# EAGLE design LTC Connector Interface (EAGLE 6.4)
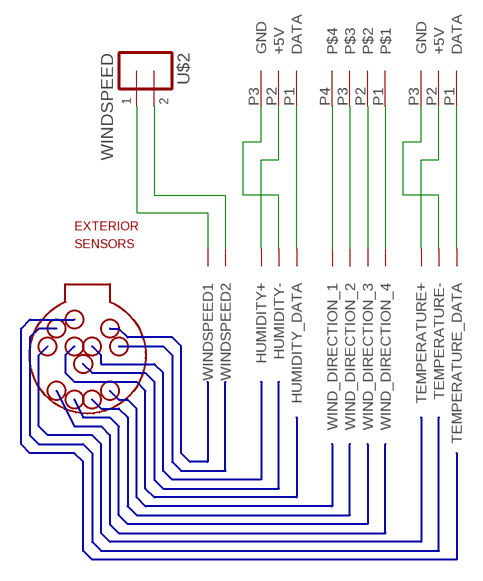
[diagram p0: schematic, sheet 1]

## Parts
HUMIDITY  MOLEX-3  [MOLEX-3]
TEMP  MOLEX-3  [MOLEX-3]
U$1  LAYOUT-LEMO-12PIN  [LEMO-12]
U$2  WINDSPEED  SCREW-TERMINAL-5MM  [SCREW-TERM-5MM]
WINDDIRECTION  MOLEX-4  [MOLEX-4]

## Nets
N$1: U$1.P6(WINDSPEED1) U$2.1
N$2: U$1.P5(WINDSPEED2) U$2.2
N$3: U$1.P3(WIND_DIRECTION_3) WINDDIRECTION.P2
N$4: U$1.P10(WIND_DIRECTION_2) WINDDIRECTION.P3
N$5: U$1.P11(WIND_DIRECTION_1) WINDDIRECTION.P4
N$6: U$1.P4(WIND_DIRECTION_4) WINDDIRECTION.P1
N$7: TEMP.P1(DATA) U$1.P1(TEMPERATURE_DATA)
N$8: TEMP.P3(GND) U$1.P8(TEMPERATURE-)
N$9: TEMP.P2(+5V) U$1.P7(TEMPERATURE+)
N$10: HUMIDITY.P1(DATA) U$1.P2(HUMIDITY_DATA)
N$11: HUMIDITY.P2(+5V) U$1.P12(HUMIDITY+)
N$12: HUMIDITY.P3(GND) U$1.P9(HUMIDITY-)

## Library data of the parts
HUMIDITY TEMP = launch-tower:MOLEX-3
U$1 = launch-tower:LAYOUT-LEMO-12PIN
U$2 = launch-tower:SCREW-TERMINAL-5MM
WINDDIRECTION = launch-tower:MOLEX-4

## Board
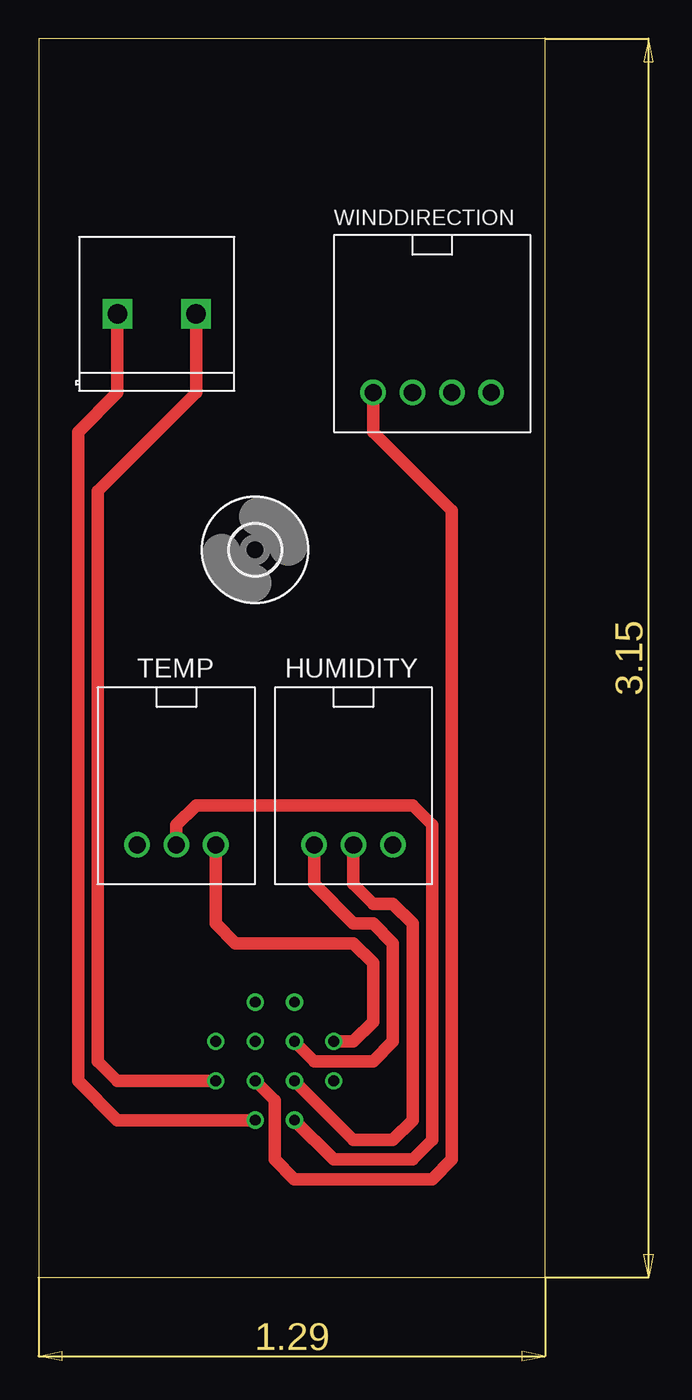
[diagram p1: board, top side]
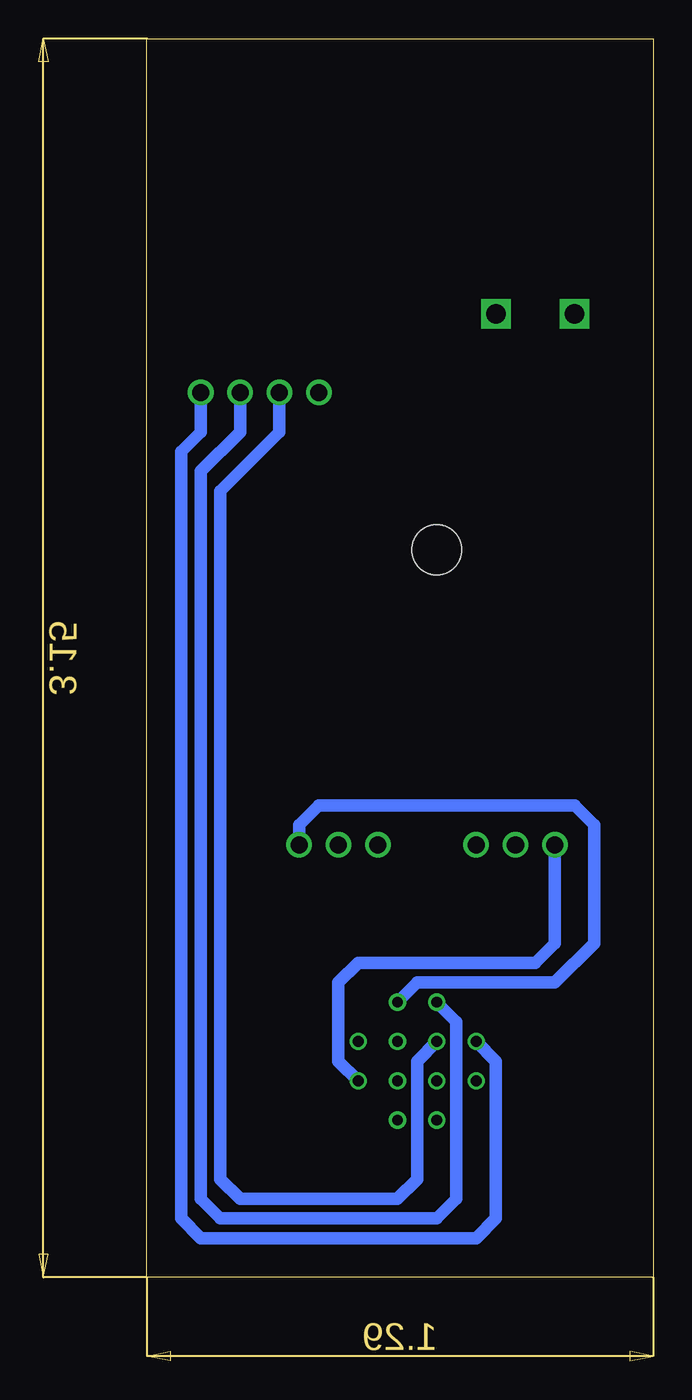
[diagram p2: board, bottom side, seen from below]

Size 32.69 x 80 mm. Coordinates in mm from the lower left corner, seen from the top.
Outline: 0,0 32.69,0 32.69,80 0,80 0,0
Copper layers (1*16): Top 0.0178mm / dielectric 59mil / Bottom 0.0178mm
Design rules "epl-lpkf": minimum track width 8mil, minimum drill 0.35mm, track to track 8mil, track to pad 8mil, pad to pad 8mil, via to via 8mil, smd to smd 8mil, copper to edge 15mil, drill to drill 15mil, minimum pad ring 8mil, minimum via ring 8mil, stop-mask expansion 3mil, vias tented up to drill 0mil, thermal gap 10mil

### Footprints (pad centres in the part's own frame; a part is rotated, then mirrored left to right if it is on the bottom)
MOLEX-3 = drill 1.1: P1 -2.54,0; P2 0,0; P3 2.54,0
LEMO-12 = drill 0.7: P1 -3.81,-1.27; P2 -1.27,-3.81; P3 1.27,-3.81; P4 3.81,-1.27; P5 3.81,1.27; P6 1.27,3.81; P7 -1.27,3.81; P8 -3.81,1.27; P9 -1.27,-1.27; P10 1.27,-1.27; P11 1.27,1.27; P12 -1.27,1.27
SCREW-TERM-5MM = drill 1.27 square: 1 -2.54,0; 2 2.54,0
3,2 = hole 3.2: 0,0
MOLEX-4 = drill 1.1: P1 -2.54,0; P2 0,0; P3 2.54,0; P4 5.08,0

### Placement (x,y rotation side)
HUMIDITY  20.32,27.94 180 top
TEMP  8.89,27.94 180 top
U$1  15.24,13.97 180 top
U$2  7.62,62.23 0 top
U$3  [3,2]  13.97,46.99 0 top
WINDDIRECTION  26.67,57.15 180 top

### Tracks (layer width: path | path; a pad name or v marks a point on that pad's centre or on a via)
N$1
  Top 0.813: U$1.P6 5.08,10.16 2.54,12.7 2.54,54.61 5.08,57.15 U$2.1
N$2
  Top 0.813: U$1.P5 5.08,12.7 3.81,13.97 3.81,50.8 10.16,57.15 U$2.2
N$3
  Bottom 0.813: U$1.P3 12.7,16.51 12.7,5.08 13.97,3.81 27.94,3.81 29.21,5.08 29.21,52.07 26.67,54.61 WINDDIRECTION.P2
N$4
  Bottom 0.813: U$1.P10 15.24,13.97 15.24,6.35 16.51,5.08 26.67,5.08 27.94,6.35 27.94,50.8 24.13,54.61 WINDDIRECTION.P3
N$5
  Top 0.813: U$1.P11 15.24,11.43 15.24,7.62 16.51,6.35 25.4,6.35 26.67,7.62 26.67,49.53 21.59,54.61 WINDDIRECTION.P4
N$6
  Bottom 0.813: U$1.P4 10.16,13.97 10.16,3.81 11.43,2.54 29.21,2.54 30.48,3.81 30.48,53.34 29.21,54.61 WINDDIRECTION.P1
N$7
  Top 0.813: U$1.P1 20.32,15.24 21.59,16.51 21.59,20.32 20.32,21.59 12.7,21.59 11.43,22.86 TEMP.P1
N$8
  Bottom 0.813: U$1.P8 20.32,13.97 20.32,19.05 19.05,20.32 7.62,20.32 6.35,21.59 TEMP.P3
N$9
  Top 0.813: U$1.P7 19.05,7.62 24.13,7.62 25.4,8.89 25.4,29.21 24.13,30.48 10.16,30.48 8.89,29.21 TEMP.P2
N$10
  Bottom 0.813: U$1.P2 15.24,19.05 6.35,19.05 3.81,21.59 3.81,29.21 5.08,30.48 21.59,30.48 22.86,29.21 HUMIDITY.P1
N$11
  Top 0.813: U$1.P12 20.32,8.89 22.86,8.89 24.13,10.16 24.13,22.86 22.86,24.13 21.59,24.13 20.32,25.4 HUMIDITY.P2
N$12
  Top 0.813: U$1.P9 17.78,13.97 21.59,13.97 22.86,15.24 22.86,21.59 21.59,22.86 20.32,22.86 17.78,25.4 HUMIDITY.P3